# EAGLE design test_probe_to_breadboard_adapter (EAGLE 5.07)
FF1: fulfillment by; FF2: Seeed Studio; FF3: www.seeedstudio.com; LICENSE: CC-BY-SA; URL1: http://
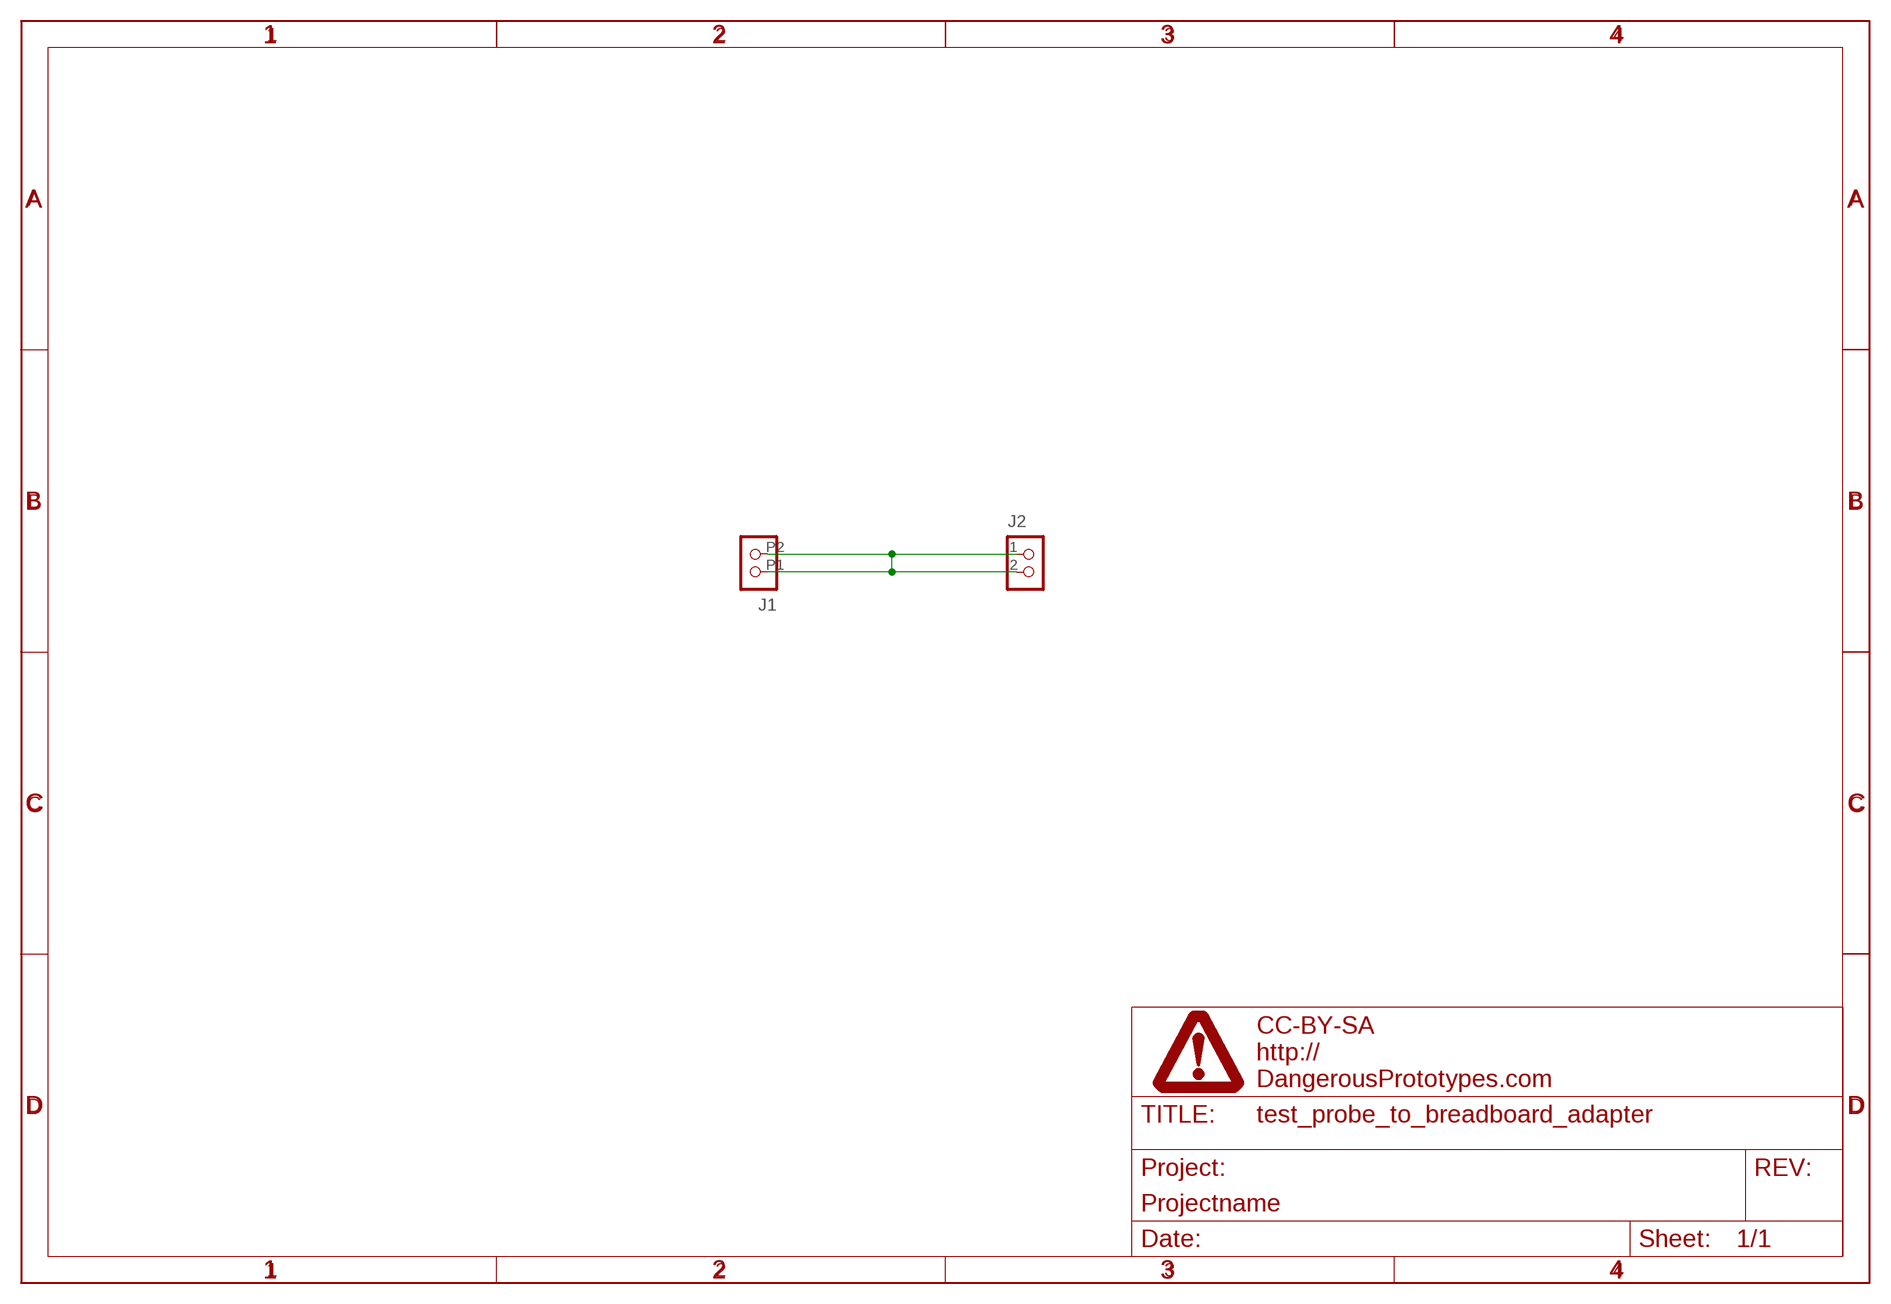
[diagram p0: schematic, sheet 1]

## Parts
J1  CON_TEST_SOCKET  [CON_MPB1_TEST_SOCKET]
J2  CON_HEADER_1X02-PTH_RIGHT_ANGLED  [M1X2_MALE_RIGHT_ANGLED]
U$1  FRAME_DINA4_L  [DP_LOGO]

## Nets
N$1: J1.P1 J1.P2 J2.1 J2.2

## Library data of the parts
J1 = dp_devices:CON_TEST_SOCKET: 2.0 mm diameter Test and measurement socket PCB mount MPB 1 <http://uk.farnell.com/hirschmann-test-measurement/mpb1-black/socket-2mm-pcb-pk5/dp/497162?ref=lookahead>
J2 = dp_devices:CON_HEADER_1X02
U$1 = dp_devices:FRAME_DINA4_L: A4 DP frame Standard Dangerous Prototypes schematic frame. Automagically adds the DP logo and standard texts to the PCB Use the atrribute in the schematic editor to change the fields.; FF1: fulfillment by; FF2: Seeed Studio; FF3: www.seeedstudio.com; LICENSE: CC-BY-SA; PROJECT: Projectname; URL1: http://; URL2: DangerousPrototypes.com

## Board
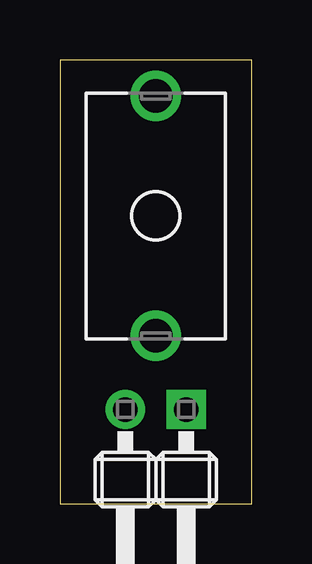
[diagram p1: board, top side]
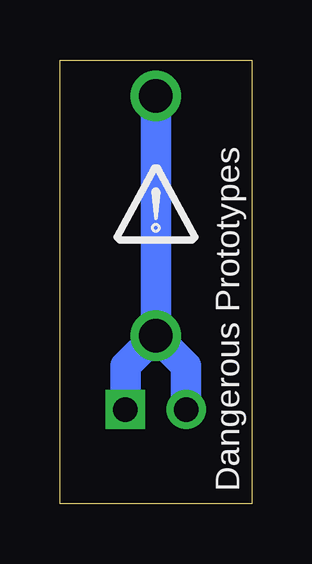
[diagram p2: board, bottom side, seen from below]

Size 8 x 18.5 mm. Coordinates in mm from the lower left corner, seen from the top.
Outline: 0,0 8,0 8,18.5 0,18.5 0,0
Copper layers (1*16): Top 0.035mm / dielectric 1.5mm / Bottom 0.035mm
Design rules "Fusion_eagle_rule_v1.1": minimum track width 6mil, minimum drill 12mil, track to track 6mil, track to pad 6mil, pad to pad 6mil, via to via 6mil, smd to smd 0mil, copper to edge 10mil, drill to drill 10mil, minimum pad ring 10mil, minimum via ring 6mil, stop-mask expansion 2mil, vias tented up to drill 100mil, thermal gap 10mil

### Footprints (pad centres in the part's own frame; a part is rotated, then mirrored left to right if it is on the bottom)
CON_MPB1_TEST_SOCKET = drill 1.4 round: P1 0,-5; P2 0,5
M1X2_MALE_RIGHT_ANGLED = drill 1.02 pad 1.632 square: 1 -1.27,-2.925 | drill 1.02 pad 1.632 round: 2 1.27,-2.925

### Placement (x,y rotation side)
J1  4,12 0 top
J2  4,1 180 top
U$1  4,11.5 0 bottom

### Tracks (layer width: path | path; a pad name or v marks a point on that pad's centre or on a via)
N$1
  Bottom 1.27: J1.P1 J1.P2 | J2.2 2.73,5.73 J1.P1 | J2.1 5.27,5.73 J1.P1

### Text on the board
bPlace: Dangerous Prototypes